# Altium schematic sheet Sheet_1_2020-07-27_09-10-31.schdoc
size 140 x 83 mm
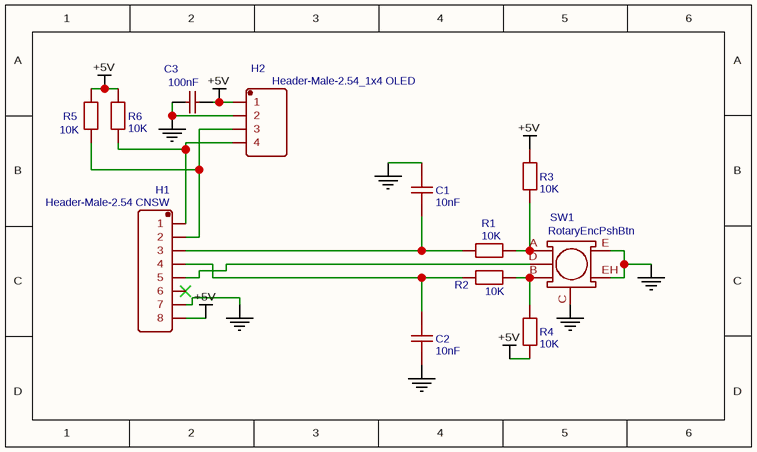
[diagram p0: Sheet_1_2020-07-27_09-10-31.schdoc]

## Parts
C1  10nF  [CAP-TH_L5.0-W2.5-P2.54-D0.7]
C2  10nF  [CAP-TH_L5.0-W2.5-P2.54-D0.7]
C3  100nF  [CAP-TH_L5.0-W2.5-P2.54-D0.7]
H1  Header-Male-2.54 CNSW  [HDR-TH_8P-P2.54-V-M]
H2  Header-Male-2.54_1x4 OLED  [HDR-TH_4P-P2.54-V]
R1  10K  [RES-TH_BD2.4-L6.3-P10.30-D0.6]
R2  10K  [RES-TH_BD2.4-L6.3-P10.30-D0.6]
R3  10K  [RES-TH_BD2.4-L6.3-P10.30-D0.6]
R4  10K  [RES-TH_BD2.4-L6.3-P10.30-D0.6]
R5  10K  [RES-TH_BD2.4-L6.3-P10.30-D0.6]
R6  10K  [RES-TH_BD2.4-L6.3-P10.30-D0.6]
SW1  RotaryEncPshBtn  [SW-TH_ EC11M1565403]

## Nets
+5V: C3.2 H1.8 H2.1 R3.2 R4.1 R5.2 R6.2
GND: C1.2 C2.1 C3.1 H1.7 H2.2 SW1.C SW1.E SW1.EH
NetC1_1: C1.1 H1.3 R1.1
NetC2_2: C2.2 H1.4 R2.1
NetH1_1: H1.1 H2.4 R6.1
NetH1_2: H1.2 H2.3 R5.1
NetH1_5: H1.5 SW1.D
NetR1_2: R1.2 R3.1 SW1.A
NetR2_2: R2.2 R4.2 SW1.B

Not connected (* = marked no-connect by the designer): H1 6*

## Library data of the parts
C1 C2 = 10nF: BOM_Manufacturer: Dersonic; BOM_Manufacturer Part: CC1H103ZA1AD3F4D10MF; nameAlias: Capacitance; Contributor: LCSC; BOM_Supplier: LCSC; BOM_Supplier Part: C254082; spicePre: C; spiceSymbolName: CC1H103ZA1AD3F4D10MF
C3 = 100nF: BOM_Manufacturer: ReliaPro; BOM_Manufacturer Part: CS1F5.6Y5V1A104Z; nameAlias: Value; BOM_Supplier: LCSC; BOM_Supplier Part: C9306; spicePre: C; spiceSymbolName: CS1F5.6Y5V1A104Z
H1 = Header-Male-2.54 CNSW: BOM_Manufacturer: Ckmtw; BOM_Manufacturer Part: 210S-1*8P L=11.6MMGold-plated black; Contributor: LCSC; BOM_Supplier: LCSC; BOM_Supplier Part: C124381; spicePre: H; spiceSymbolName: Header-Male-2.54_1x8
H2 = Header-Male-2.54_1x4 OLED: BOM_Manufacturer: Ckmtw; BOM_Manufacturer Part: 210S-1*4P L=11.6MMGold-plated black; Contributor: LCSC; Package Display: No; BOM_Supplier: LCSC; BOM_Supplier Part: C124378; spicePre: H; spiceSymbolName: Header-Male-2.54_1x4
R1-R6 = 10K: BOM_Manufacturer: TyoHM; BOM_Manufacturer Part: RN 1/4W 10K F T/B A1; nameAlias: Resistance (Ohms); Contributor: LCSC; BOM_Supplier: LCSC; BOM_Supplier Part: C410695; spicePre: R; spiceSymbolName: RN 1/4W 10K F T/B A1
SW1 = RotaryEncPshBtn: BOM_Manufacturer: ALPS Electric; BOM_Manufacturer Part: EC11G1560414; Contributor: LCSC; Package Display: No; BOM_Supplier: LCSC; BOM_Supplier Part: C470719; spicePre: S; spiceSymbolName: EC11G1560414